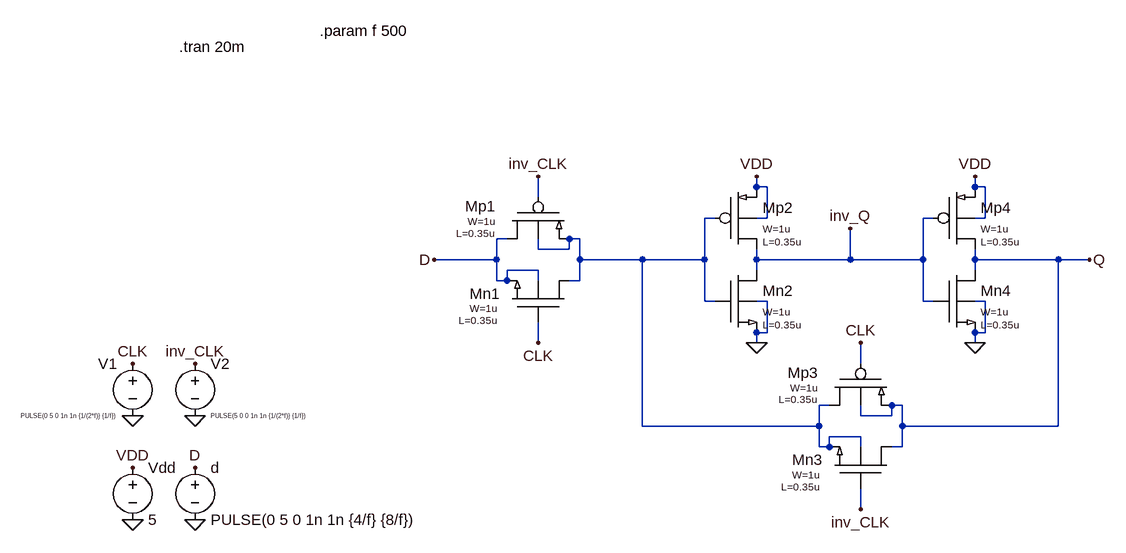
[diagram p0: schematic flop_flop.asc]
flop_flop.asc, the LTspice schematic file:
Version 4.1
SHEET 1 1492 680
WIRE 944 -112 944 -128
WIRE 960 -112 944 -112
WIRE 1280 -112 1280 -128
WIRE 1296 -112 1280 -112
WIRE 608 -96 608 -128
WIRE 880 -64 864 -64
WIRE 960 -64 960 -112
WIRE 960 -64 944 -64
WIRE 1216 -64 1200 -64
WIRE 1296 -64 1296 -112
WIRE 1296 -64 1280 -64
WIRE 560 -32 544 -32
WIRE 672 -32 656 -32
WIRE 608 -16 608 -32
WIRE 656 -16 656 -32
WIRE 656 -16 608 -16
WIRE 544 0 544 -32
WIRE 544 0 448 0
WIRE 672 0 672 -32
WIRE 768 0 672 0
WIRE 864 0 864 -64
WIRE 864 0 768 0
WIRE 944 0 944 -16
WIRE 1088 0 1088 -48
WIRE 1088 0 944 0
WIRE 1200 0 1200 -64
WIRE 1200 0 1088 0
WIRE 1280 0 1280 -16
WIRE 1408 0 1280 0
WIRE 1456 0 1408 0
WIRE 608 16 560 16
WIRE 944 16 944 0
WIRE 1280 16 1280 0
WIRE 544 32 544 0
WIRE 560 32 560 16
WIRE 560 32 544 32
WIRE 608 32 608 16
WIRE 672 32 672 0
WIRE 672 32 656 32
WIRE 864 64 864 0
WIRE 880 64 864 64
WIRE 960 64 944 64
WIRE 1200 64 1200 0
WIRE 1216 64 1200 64
WIRE 1296 64 1280 64
WIRE 960 112 960 64
WIRE 960 112 944 112
WIRE 1296 112 1296 64
WIRE 1296 112 1280 112
WIRE 608 128 608 96
WIRE 944 128 944 112
WIRE 1280 128 1280 112
WIRE 1104 160 1104 128
WIRE 1056 224 1040 224
WIRE 1168 224 1152 224
WIRE 1104 240 1104 224
WIRE 1152 240 1152 224
WIRE 1152 240 1104 240
WIRE 768 256 768 0
WIRE 1040 256 1040 224
WIRE 1040 256 768 256
WIRE 1168 256 1168 224
WIRE 1408 256 1408 0
WIRE 1408 256 1168 256
WIRE 1104 272 1056 272
WIRE 1040 288 1040 256
WIRE 1056 288 1056 272
WIRE 1056 288 1040 288
WIRE 1104 288 1104 272
WIRE 1168 288 1168 256
WIRE 1168 288 1152 288
WIRE 1104 384 1104 352
FLAG -16 240 0
FLAG -16 160 CLK
FLAG 80 240 0
FLAG 80 160 inv_CLK
FLAG 608 128 CLK
FLAG 608 -128 inv_CLK
FLAG 80 400 0
FLAG 80 320 D
FLAG 448 0 D
FLAG -16 400 0
FLAG -16 320 VDD
FLAG 944 -128 VDD
FLAG 944 128 0
FLAG 1104 128 CLK
FLAG 1104 384 inv_CLK
FLAG 1280 -128 VDD
FLAG 1280 128 0
FLAG 1456 0 Q
FLAG 1088 -48 inv_Q
SYMBOL voltage -16 144 M0
WINDOW 3 24 96 Left 0
WINDOW 123 0 0 Left 0
WINDOW 39 0 0 Left 0
SYMATTR InstName V1
SYMATTR Value PULSE(0 5 0 1n 1n {1/(2*f)} {1/f})
SYMBOL voltage 80 144 R0
WINDOW 3 24 96 Left 0
WINDOW 123 0 0 Left 0
WINDOW 39 0 0 Left 0
SYMATTR InstName V2
SYMATTR Value PULSE(5 0 0 1n 1n {1/(2*f)} {1/f})
SYMBOL EE551\\NMOS4 608 96 M270
WINDOW 123 21 63 VRight 1
WINDOW 39 3 63 VRight 1
WINDOW 0 44 58 VRight 2
SYMATTR InstName Mn1
SYMBOL EE551\\PMOS4 608 -96 R90
WINDOW 123 37 66 VRight 1
WINDOW 39 55 67 VRight 1
WINDOW 0 14 65 VRight 2
SYMATTR InstName Mp1
SYMBOL voltage 80 304 R0
WINDOW 123 0 0 Left 0
WINDOW 39 0 0 Left 0
SYMATTR InstName d
SYMATTR Value PULSE(0 5 0 1n 1n {4/f} {8/f})
SYMBOL EE551\\NMOS4 880 64 R0
WINDOW 123 73 16 Left 1
WINDOW 39 73 36 Left 1
SYMATTR InstName Mn2
SYMBOL EE551\\PMOS4 880 -64 R0
WINDOW 123 73 16 Left 1
WINDOW 39 73 36 Left 1
SYMATTR InstName Mp2
SYMBOL voltage -16 304 R0
SYMATTR InstName Vdd
SYMATTR Value 5
SYMBOL EE551\\NMOS4 1104 352 M270
WINDOW 123 21 63 VRight 1
WINDOW 39 3 63 VRight 1
WINDOW 0 44 58 VRight 2
SYMATTR InstName Mn3
SYMBOL EE551\\PMOS4 1104 160 R90
WINDOW 123 37 66 VRight 1
WINDOW 39 55 67 VRight 1
WINDOW 0 14 65 VRight 2
SYMATTR InstName Mp3
SYMBOL EE551\\NMOS4 1216 64 R0
WINDOW 123 73 16 Left 1
WINDOW 39 73 36 Left 1
SYMATTR InstName Mn4
SYMBOL EE551\\PMOS4 1216 -64 R0
WINDOW 123 73 16 Left 1
WINDOW 39 73 36 Left 1
SYMATTR InstName Mp4
TEXT 56 -328 Left 2 !.tran 20m
TEXT 272 -352 Left 2 !.param f 500

The netlist it stands for:
* flop_flop.asc
V1 CLK 0 PULSE(0 5 0 1n 1n {1/(2*f)} {1/f})
V2 inv_CLK 0 PULSE(5 0 0 1n 1n {1/(2*f)} {1/f})
X§Mn1 N001 CLK D D NFET W=1u L=0.35u  ; pins Vd Vg Vs Vb
X§Mp1 D inv_CLK N001 N001 PFET W=1u L=0.35u  ; pins Vd Vg Vs Vw
V§d D 0 PULSE(0 5 0 1n 1n {4/f} {8/f})
X§Mn2 inv_Q N001 0 0 NFET W=1u L=0.35u  ; pins Vd Vg Vs Vb
X§Mp2 inv_Q N001 VDD VDD PFET W=1u L=0.35u  ; pins Vd Vg Vs Vw
Vdd VDD 0 5
X§Mn3 Q inv_CLK N001 N001 NFET W=1u L=0.35u  ; pins Vd Vg Vs Vb
X§Mp3 N001 CLK Q Q PFET W=1u L=0.35u  ; pins Vd Vg Vs Vw
X§Mn4 Q inv_Q 0 0 NFET W=1u L=0.35u  ; pins Vd Vg Vs Vb
X§Mp4 Q inv_Q VDD VDD PFET W=1u L=0.35u  ; pins Vd Vg Vs Vw
.tran 20m
.param f 500
.lib ee551.lib
.backanno
.end

* Results of the author's LTspice run, read from the files saved beside the schematic
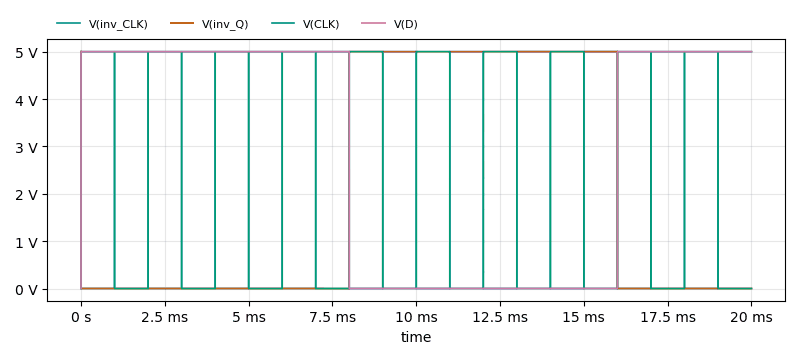
[diagram p1: Transient Analysis of flop_flop.asc, plotted from the saved traces]
* Transient Analysis, 1 run:
*   V(inv_CLK): min 0 V, max 5 V, average 2.5 V, rms 3.536 V, last 5 V
*   V(inv_Q): min -7.143 mV, max 5.009 V, average 2 V, rms 3.162 V, last -13.27 µV
*   V(CLK): min 0 V, max 5 V, average 2.5 V, rms 3.536 V, last 0 V
*   V(D): min 0 V, max 5 V, average 3 V, rms 3.873 V, last 5 V